# Altium project AmplifierDclass.PrjPcb
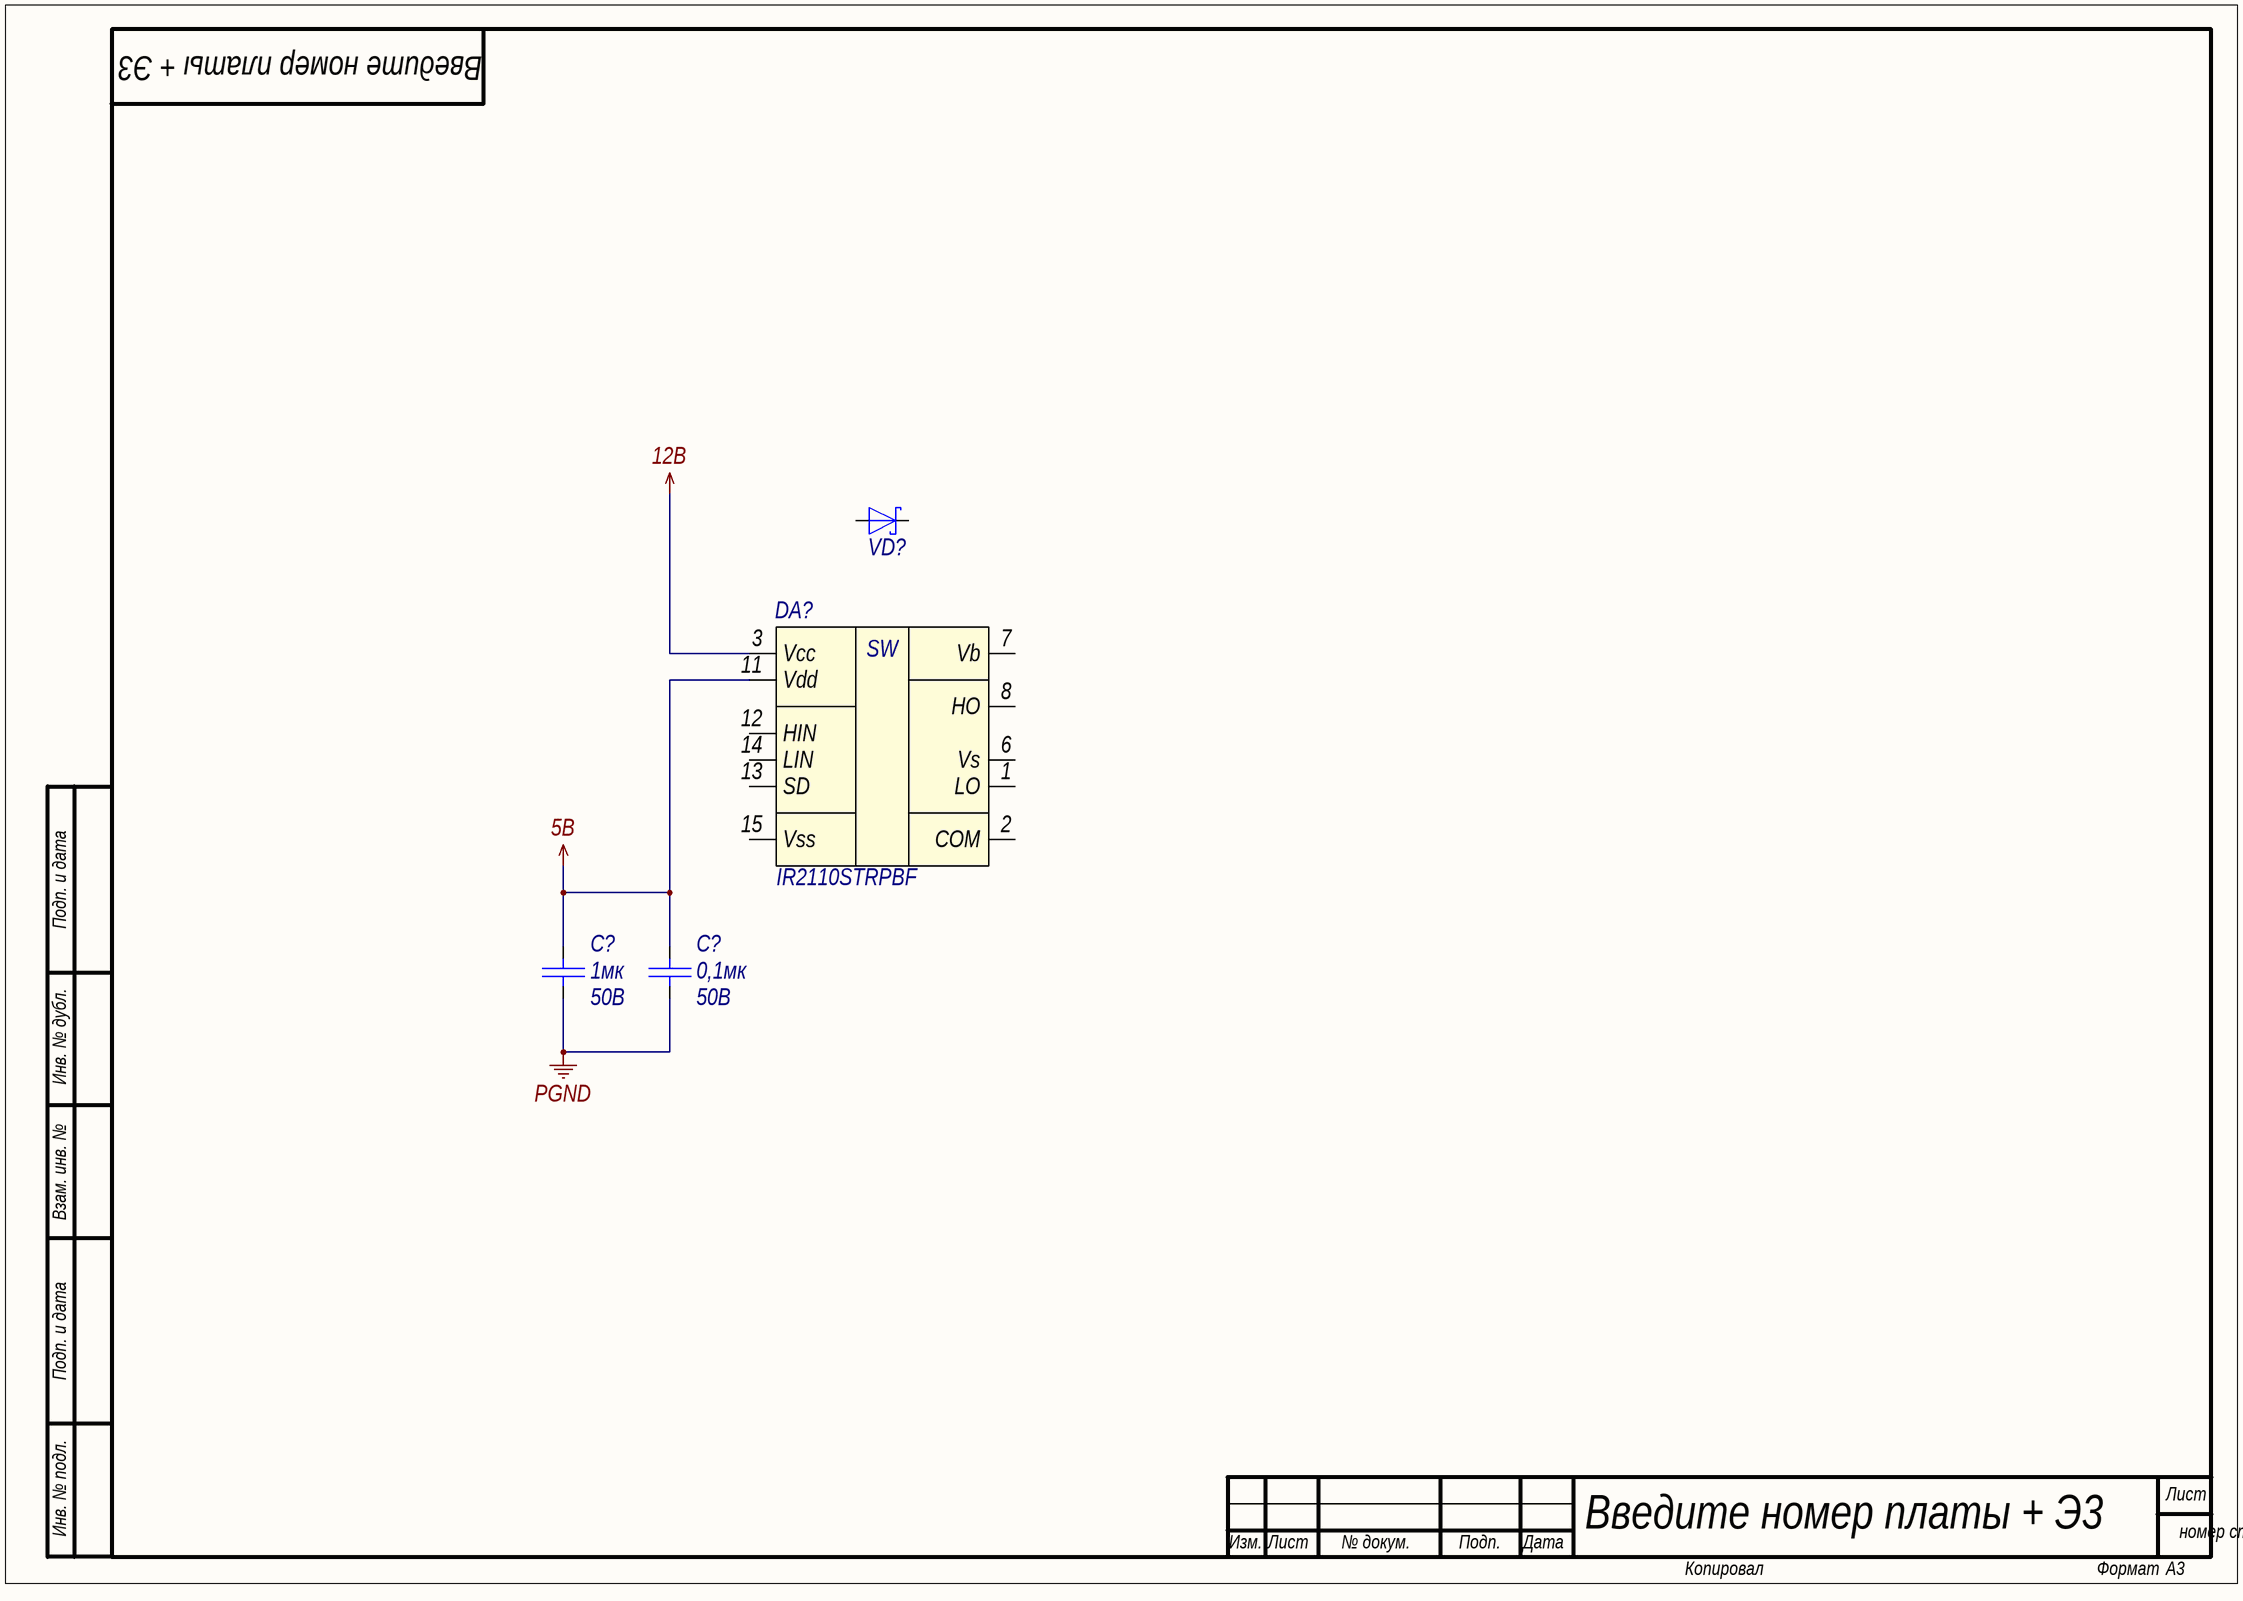
[diagram p0: AmplifierDclass_Driver.SchDoc]
6 sheets, 95 parts. Net scope: flat (ports and power ports of the same name join across sheets).
Sheets:
  AmplifierDclass_Driver.SchDoc
  AmplifierDclass_Bridge.SchDoc
  AmplifierDclass_MCU.SchDoc
  AmplifierDclass_ChokeOut.SchDoc
  AmplifierDclass_Power.SchDoc
  CutMonitor_PressureSensor.SchDoc

## Sheet AmplifierDclass_Driver.SchDoc
size 420 x 297 mm; DocumentNumber: Введите номер платы + Э3; SheetNumber: номер страницы; Format: A3

### Parts
(Parts that share a designator on the sheet are numbered #1, #2 ... from top to bottom, then left to right.)
C?#1  value 1мк  Voltage: 50B  [C0805]  (hidden comment: Capacitor)
C?#2  value 0,1мк  Voltage: 50В  [C0805]  (hidden comment: Capacitor)
DA?  Part Number: IR2110STRPBF  [SO16]  (hidden comment: IR2110S)
VD?#1  DiodeSchottky  [SMA]  (value not drawn)

### Nets
5B: C?#1.2 C?#2.2 DA?.11(Vdd)
12B: DA?.3(Vcc)
PGND: C?#1.1 C?#2.1

Not connected (* = marked no-connect by the designer): DA? 1(LO) 2(COM) 6(Vs) 7(Vb) 8(HO) 12(HIN) 13(SD) 14(LIN) 15(Vss); VD?#1 1(K) 2(A)

### Notes on the sheet
- Подп. и дата
- Инв. № дубл.
- Взам. инв. №
- Инв. № подл.
- Лист
- Изм.
- № докум.
- Подп.
- Дата
- Копировал
- Формат
- (in symbol driver23) SW

### Library data of the parts
C?#1 = cap151: Конденсатор; Part Name: Ceramic; Manufacture: Murata; Part Number: GRM21BR71H105K; id: cap151; TKE: X7R
C?#2 = cap160: Конденсатор; Part Name: Ceramic; Manufacture: Murata; Part Number: GRM21BR71H104KA01L; id: cap160; TKE: X7R
DA? = driver23: High and Low Side Driver; Manufacture: International Rectifier; Logic High: 3-20B; Logic Low: 1,5-8B; Min Operating Supply Voltage: 10B; Max Operating Supply Voltage: 20B; Maximum output current: 2,5A; id: driver23; Part Name: High and Low side Driver
VD?#1 = diode1: Диод Шоттки; Part Number: SK34A; Manufacture: Taiwan Semiconductor; id: diode1; Max Reverse Voltage: 40B; Forward Voltage: 0,55B; Forward Current: 3A; Part Name: Diode Schottky

## Sheet AmplifierDclass_Bridge.SchDoc
size 420 x 297 mm; DocumentNumber: Введите номер платы + Э3; SheetNumber: номер страницы; Format: A3
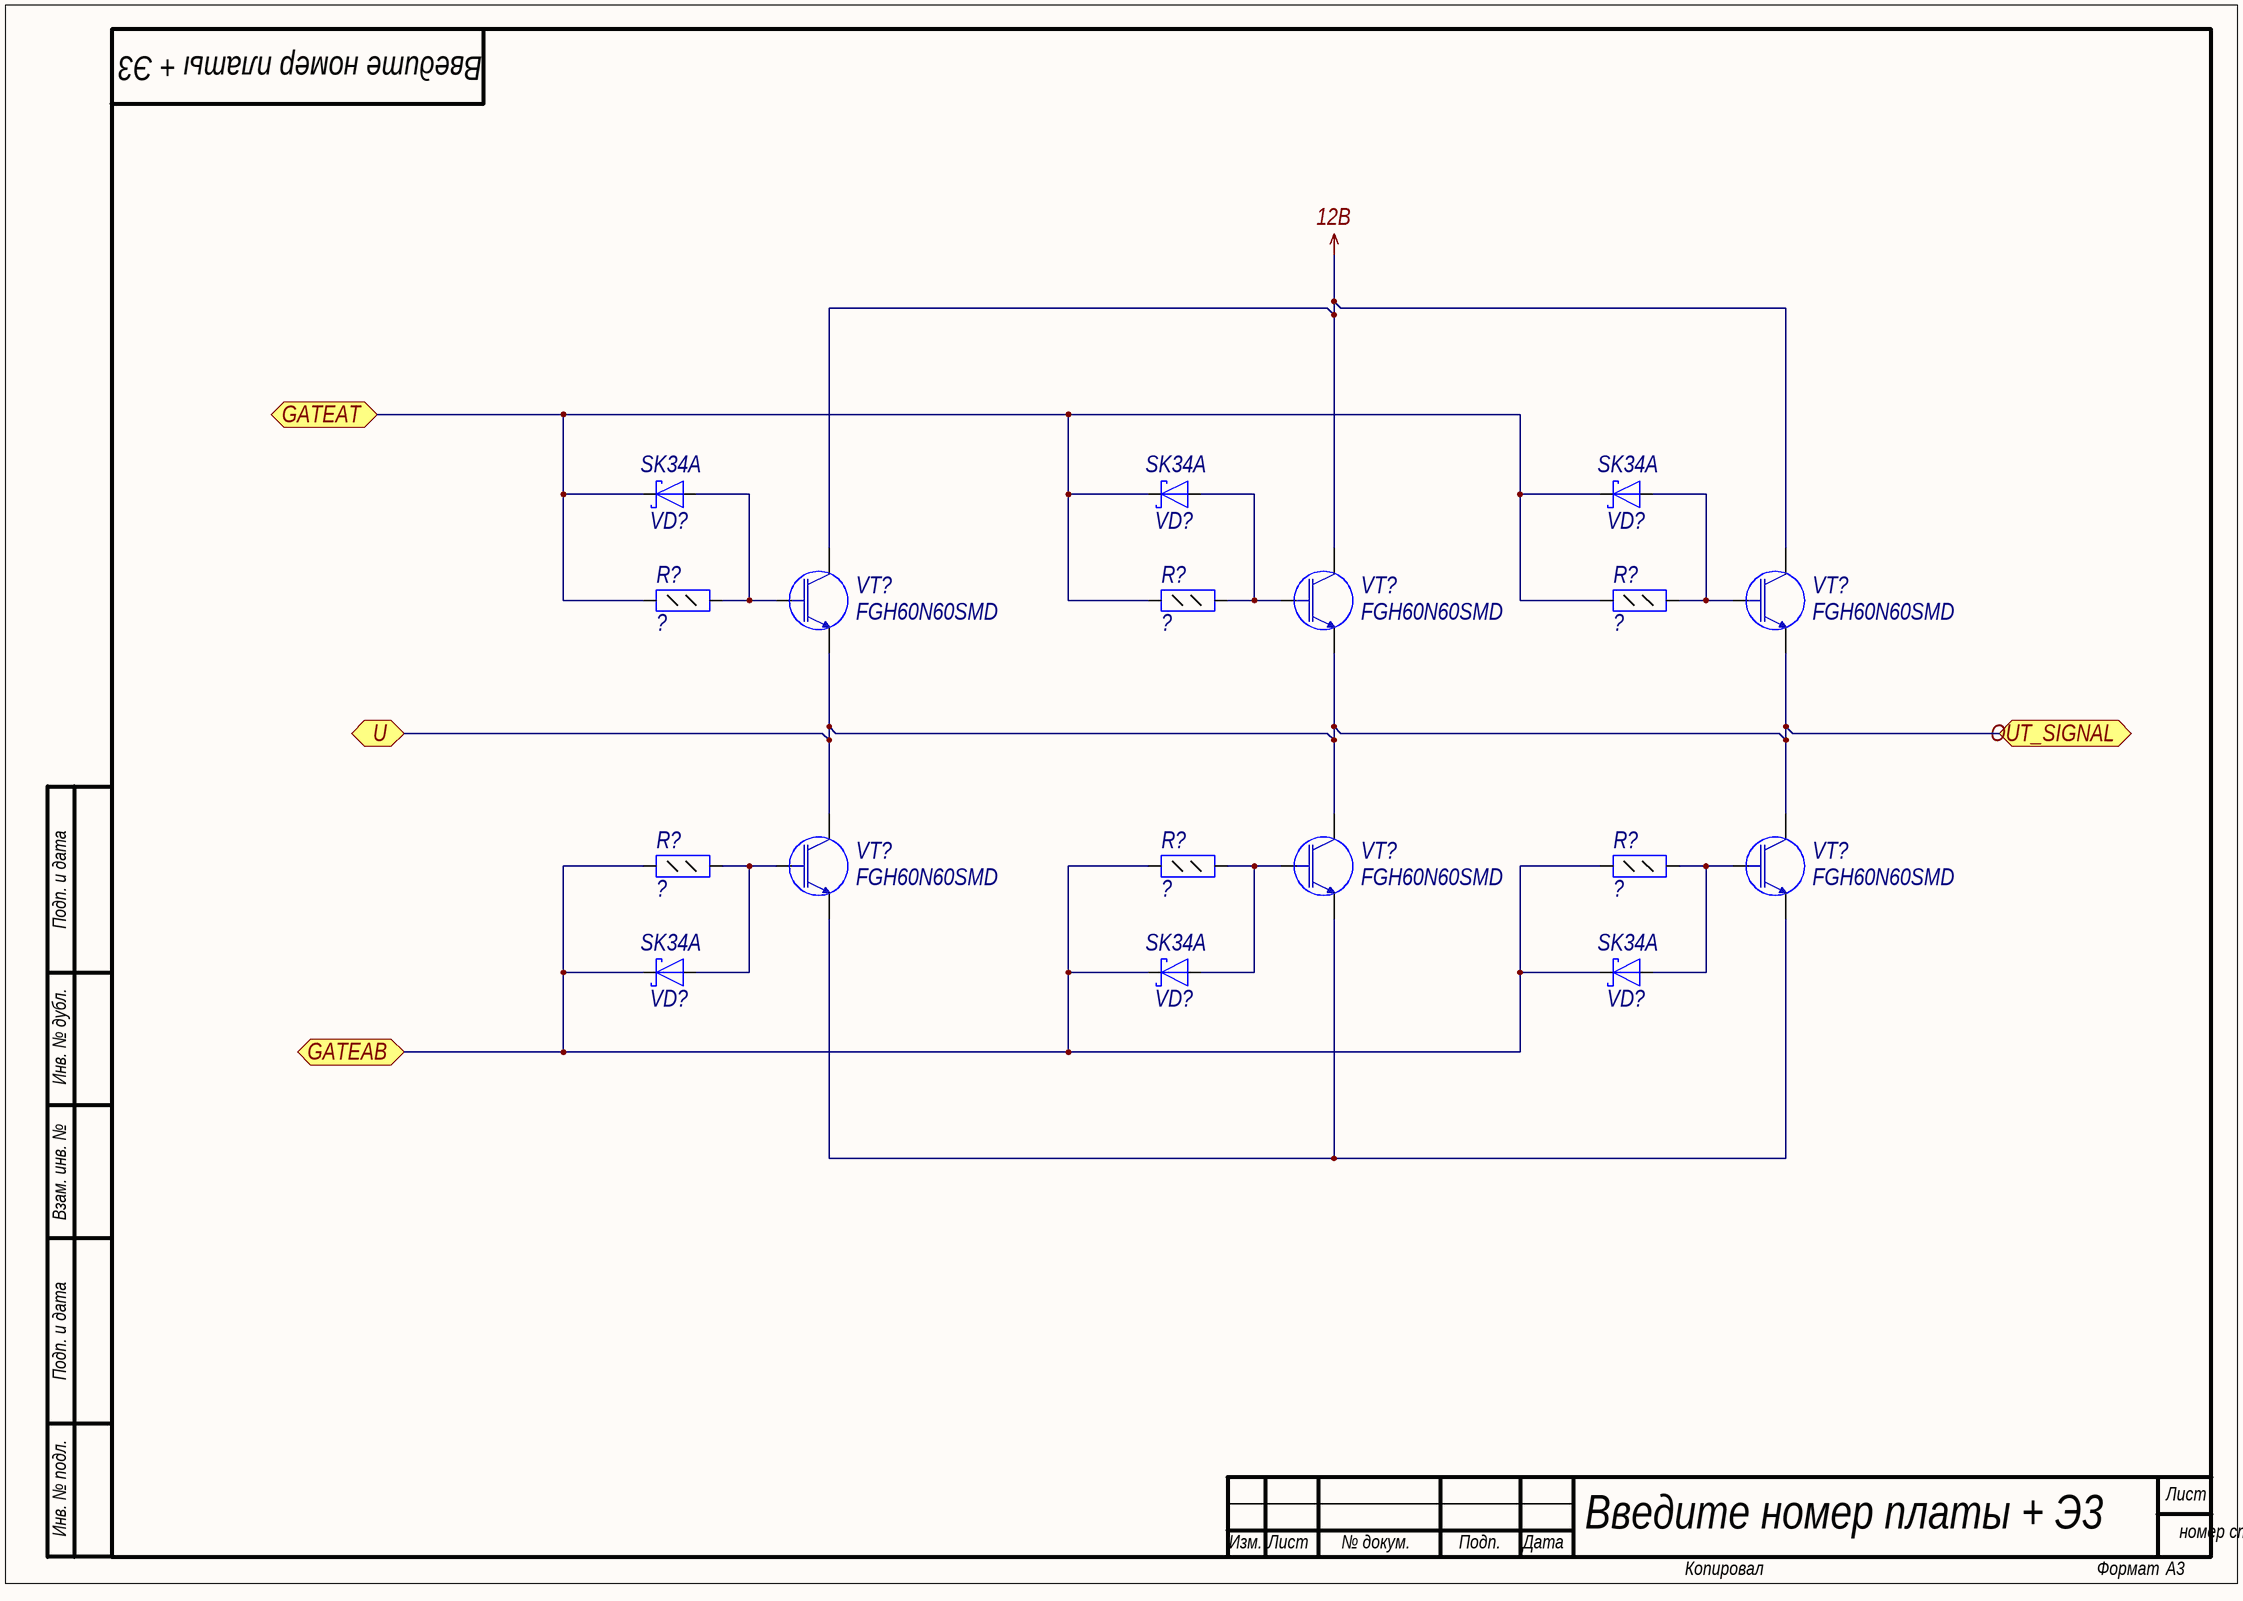
[diagram p1: AmplifierDclass_Bridge.SchDoc]

### Parts
(Parts that share a designator on the sheet are numbered #1, #2 ... from top to bottom, then left to right.)
R?#1  Resistor_0,125Вт  [R0805]  (value not drawn)
R?#2  Resistor_0,125Вт  [R0805]  (value not drawn)
R?#3  Resistor_0,125Вт  [R0805]  (value not drawn)
R?#4  Resistor_0,125Вт  [R0805]  (value not drawn)
R?#5  Resistor_0,125Вт  [R0805]  (value not drawn)
R?#6  Resistor_0,125Вт  [R0805]  (value not drawn)
VD?#2  Part Number: SK34A  [SMA]  (hidden comment: DiodeSchottky)
VD?#3  Part Number: SK34A  [SMA]  (hidden comment: DiodeSchottky)
VD?#4  Part Number: SK34A  [SMA]  (hidden comment: DiodeSchottky)
VD?#5  Part Number: SK34A  [SMA]  (hidden comment: DiodeSchottky)
VD?#6  Part Number: SK34A  [SMA]  (hidden comment: DiodeSchottky)
VD?#7  Part Number: SK34A  [SMA]  (hidden comment: DiodeSchottky)
VT?#1  Part Number: FGH60N60SMD  [TO-247_V]  (hidden comment: IGBT)
VT?#2  Part Number: FGH60N60SMD  [TO-247_V]  (hidden comment: IGBT)
VT?#3  Part Number: FGH60N60SMD  [TO-247_V]  (hidden comment: IGBT)
VT?#4  Part Number: FGH60N60SMD  [TO-247_V]  (hidden comment: IGBT)
VT?#5  Part Number: FGH60N60SMD  [TO-247_V]  (hidden comment: IGBT)
VT?#6  Part Number: FGH60N60SMD  [TO-247_V]  (hidden comment: IGBT)

### Ports
GATEAB, GATEAT, OUT_SIGNAL, U

### Nets
12B: VT?#1.2(С) VT?#2.2(С) VT?#3.2(С)
NetR?#1_1: R?#1.1 R?#2.1 R?#3.1 VD?#2.1(K) VD?#3.1(K) VD?#4.1(K) ; port GATEAT
NetR?#1_2: R?#1.2 VD?#2.2(A) VT?#1.1(G)
NetR?#2_2: R?#2.2 VD?#3.2(A) VT?#2.1(G)
NetR?#3_2: R?#3.2 VD?#4.2(A) VT?#3.1(G)
NetR?#4_1: R?#4.1 R?#5.1 R?#6.1 VD?#5.1(K) VD?#6.1(K) VD?#7.1(K) ; port GATEAB
NetR?#4_2: R?#4.2 VD?#5.2(A) VT?#4.1(G)
NetR?#5_2: R?#5.2 VD?#6.2(A) VT?#5.1(G)
NetR?#6_2: R?#6.2 VD?#7.2(A) VT?#6.1(G)
NetVT?#1_3: VT?#1.3(E) VT?#2.3(E) VT?#3.3(E) VT?#4.2(С) VT?#5.2(С) VT?#6.2(С) ; port U, port OUT_SIGNAL
NetVT?#4_3: VT?#4.3(E) VT?#5.3(E) VT?#6.3(E)

### Notes on the sheet
- Подп. и дата
- Инв. № дубл.
- Взам. инв. №
- Инв. № подл.
- Лист
- Изм.
- № докум.
- Подп.
- Дата
- Копировал
- Формат

### Library data of the parts
R?#1-R?#6 = res41: Резистор; Manufacture: Yageo; Part Number: RC0805FR-0747RL; id: res41; Accuracy: 0.01; Value: ?; Part Name: Resistor; Power: 0,125Вт
VD?#2-VD?#7 = diode1: Диод Шоттки; Manufacture: Taiwan Semiconductor; id: diode1; Max Reverse Voltage: 40B; Forward Voltage: 0,55B; Forward Current: 3A; Part Name: Diode Schottky
VT?#1-VT?#6 = FGH60N60SMD: Manufacturer: Fairchild; id: igbt0; V collector-emitter max: 600B; Gate treshold voltage: 6B(15A)-7B(45A)-8B(75A); Gate-to-emmiter voltage: (+-)20B; Total gate charge: 189 nC; Continuous collector current: 120A; Pulsed collector current: 180A; Power dissipation: 600W

## Sheet AmplifierDclass_MCU.SchDoc
size 594 x 420 mm; DocumentNumber: Введите номер платы + Э3; SheetNumber: номер страницы; Format: A2
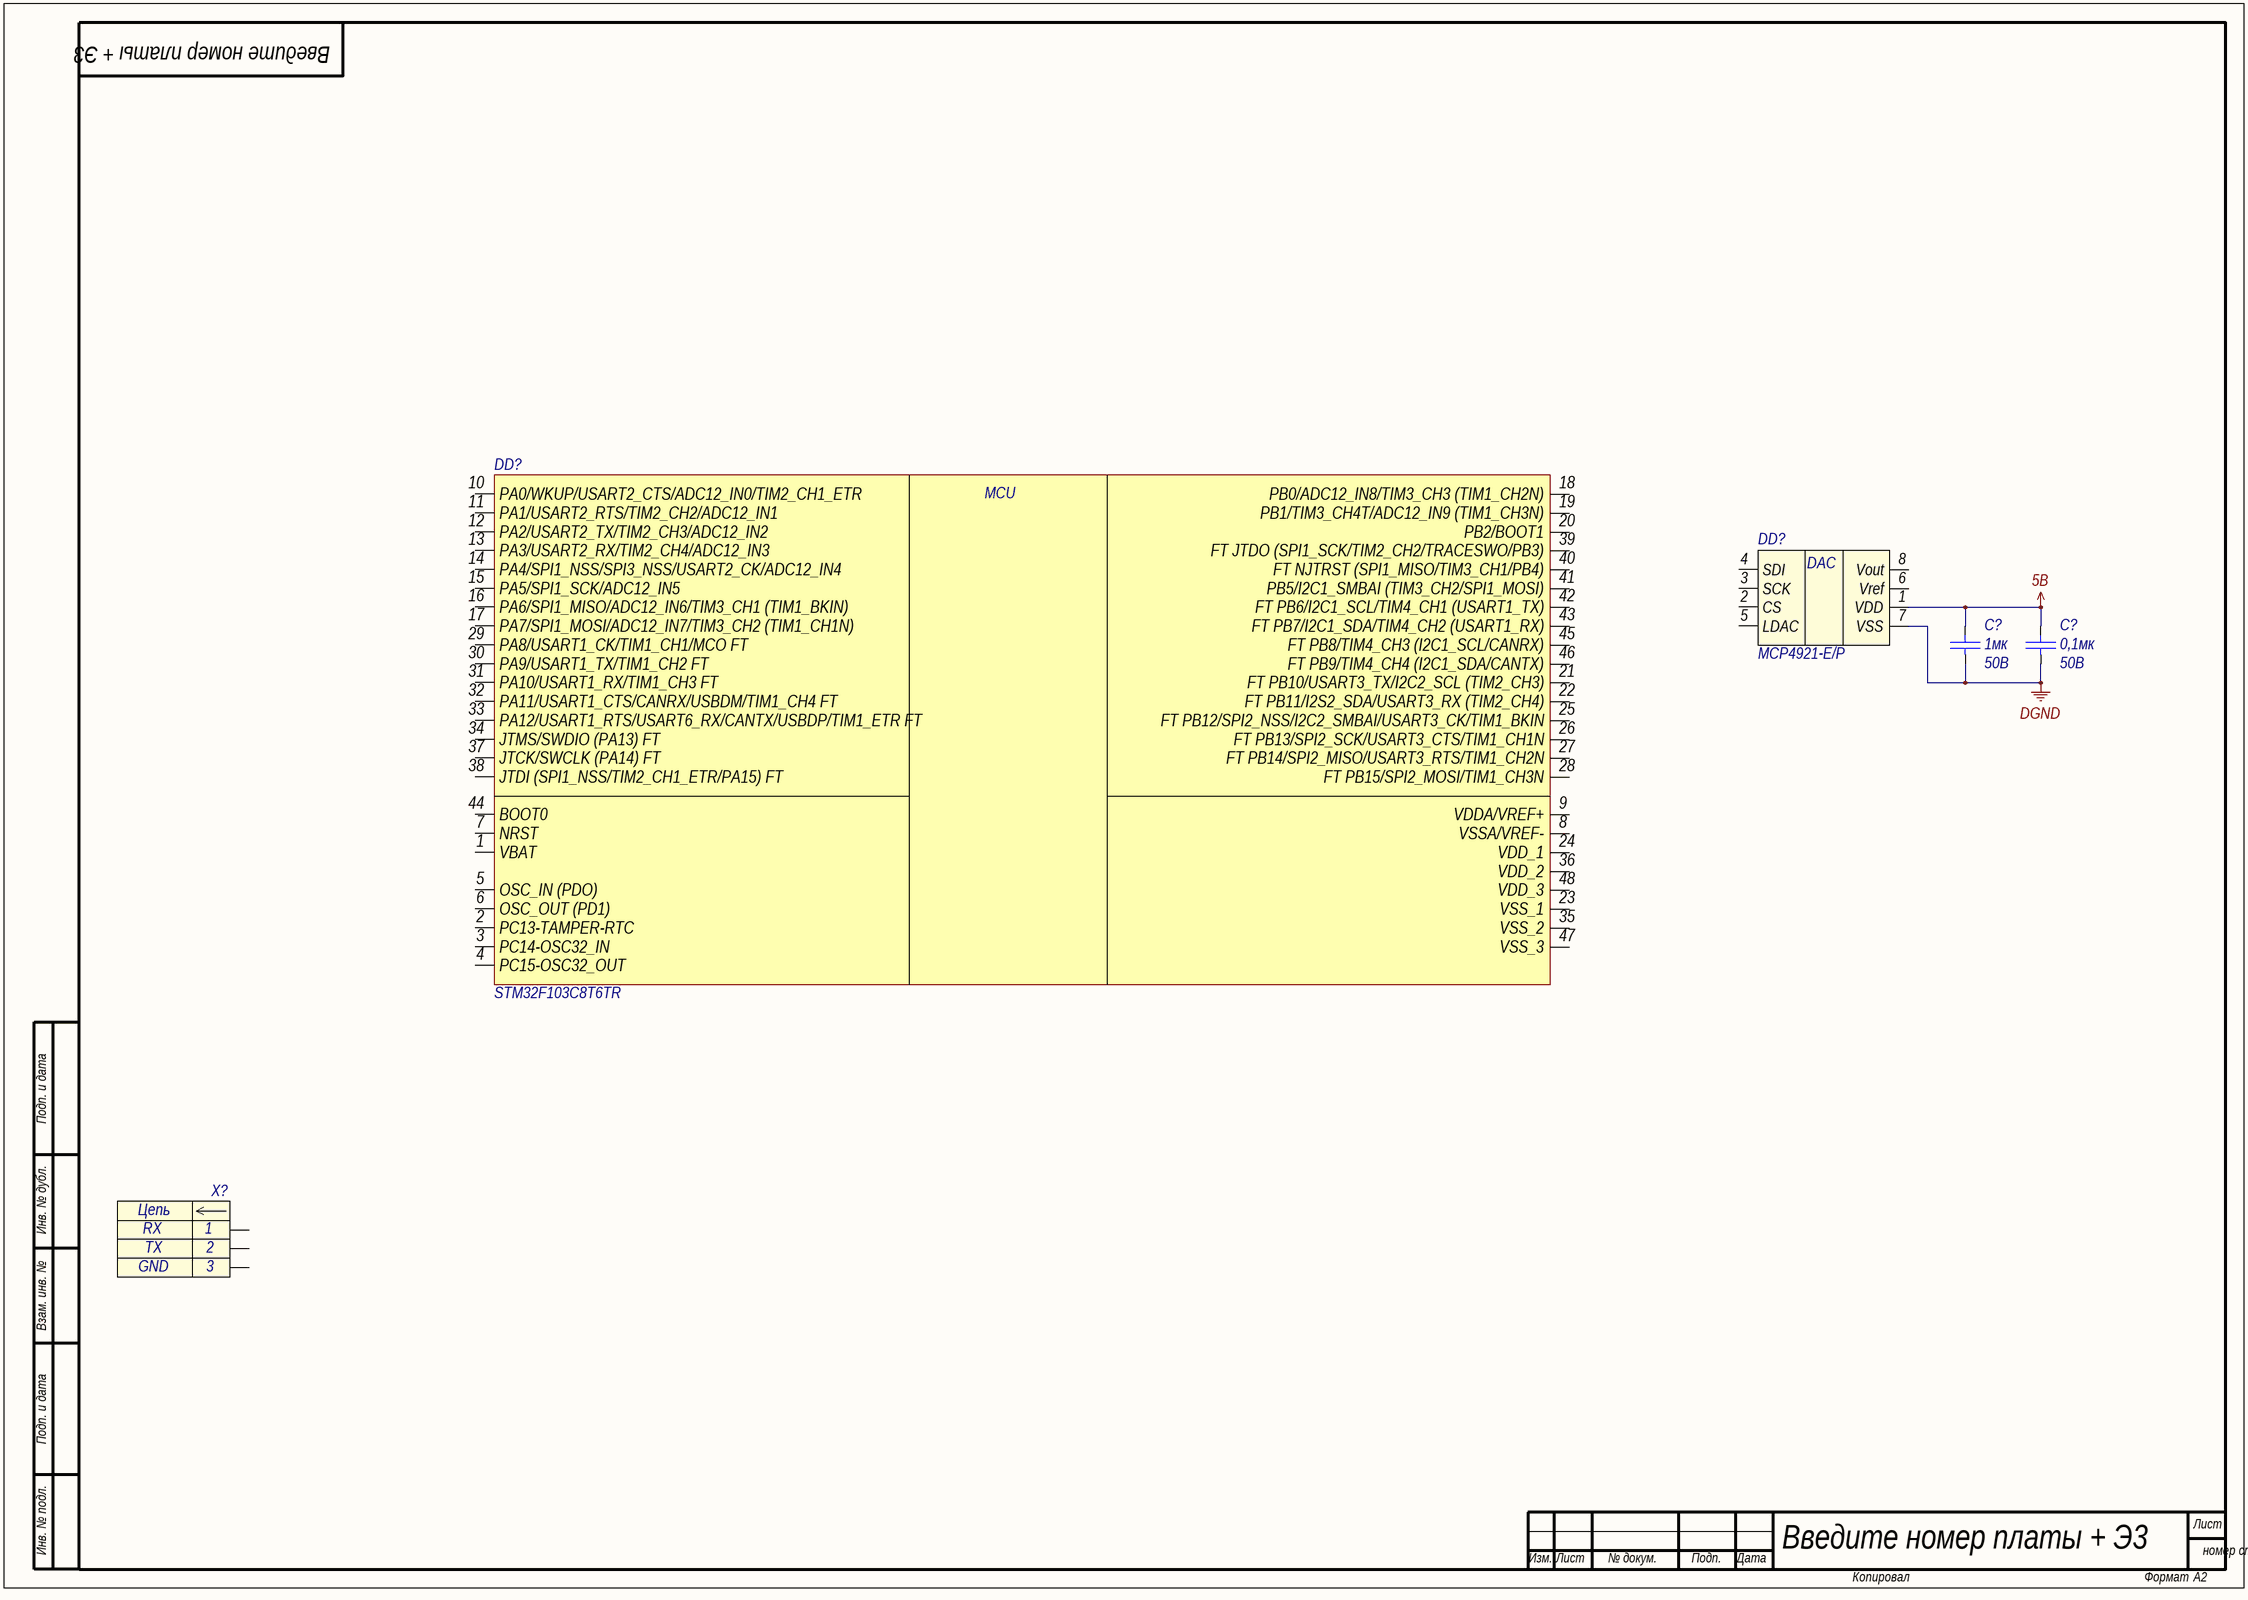
[diagram p2: AmplifierDclass_MCU.SchDoc]

### Parts
(Parts that share a designator on the sheet are numbered #1, #2 ... from top to bottom, then left to right.)
C?#3  value 1мк  Voltage: 50B  [C0805]  (hidden comment: Capacitor)
C?#4  value 0,1мк  Voltage: 50В  [C0805]  (hidden comment: Capacitor)
DD?#1  STM32F103C8T6TR  [LQFP48]
DD?#2  MCP4921-E/P  [SO8]
X?  Header_3_plg  [PLS-3]  (value not drawn)

### Nets
5B: C?#3.2 C?#4.2 DD?#2.1(VDD)
DGND: C?#3.1 C?#4.1 DD?#2.7(VSS)

Not connected (* = marked no-connect by the designer): DD?#1 1(VBAT) 2(PC13-TAMPER-RTC) 3(PC14-OSC32_IN) 4(PC15-OSC32_OUT) 5(OSC_IN_(PDO)) 6(OSC_OUT_(PD1)) 7(NRST) 8(VSSA/VREF-) 9(VDDA/VREF+) 10(PA0/WKUP/USART2_CTS/ADC12_IN0/TIM2_CH1_ETR) 11(PA1/USART2_RTS/TIM2_CH2/ADC12_IN1) 12(PA2/USART2_TX/TIM2_CH3/ADC12_IN2) 13(PA3/USART2_RX/TIM2_CH4/ADC12_IN3) 14(PA4/SPI1_NSS/SPI3_NSS/USART2_CK/ADC12_IN4) 15(PA5/SPI1_SCK/ADC12_IN5) 16(PA6/SPI1_MISO/ADC12_IN6/TIM3_CH1_(TIM1_BKIN)) 17(PA7/SPI1_MOSI/ADC12_IN7/TIM3_CH2_(TIM1_CH1N)) 18(PB0/ADC12_IN8/TIM3_CH3_(TIM1_CH2N)) 19(PB1/TIM3_CH4T/ADC12_IN9_(TIM1_CH3N)) 20(PB2/BOOT1) 21(FT_PB10/USART3_TX/I2C2_SCL_(TIM2_CH3)) 22(FT_PB11/I2S2_SDA/USART3_RX_(TIM2_CH4)) 23(VSS_1) 24(VDD_1) 25(FT_PB12/SPI2_NSS/I2C2_SMBAI/USART3_CK/TIM1_BKIN) 26(FT_PB13/SPI2_SCK/USART3_CTS/TIM1_CH1N) 27(FT_PB14/SPI2_MISO/USART3_RTS/TIM1_CH2N) 28(FT_PB15/SPI2_MOSI/TIM1_CH3N) 29(PA8/USART1_CK/TIM1_CH1/MCO_FT) 30(PA9/USART1_TX/TIM1_CH2_FT) 31(PA10/USART1_RX/TIM1_CH3_FT) 32(PA11/USART1_CTS/CANRX/USBDM/TIM1_CH4_FT) 33(PA12/USART1_RTS/USART6_RX/CANTX/USBDP/TIM1_ETR_FT) 34(JTMS/SWDIO_(PA13)_FT) 35(VSS_2) 36(VDD_2) 37(JTCK/SWCLK_(PA14)_FT) 38(JTDI_(SPI1_NSS/TIM2_CH1_ETR/PA15)_FT) 39(FT_JTDO_(SPI1_SCK/TIM2_CH2/TRACESWO/PB3)) 40(FT_NJTRST_(SPI1_MISO/TIM3_CH1/PB4)) 41(PB5/I2C1_SMBAI_(TIM3_CH2/SPI1_MOSI)) 42(FT_PB6/I2C1_SCL/TIM4_CH1_(USART1_TX)) 43(FT_PB7/I2C1_SDA/TIM4_CH2_(USART1_RX)) 44(BOOT0) 45(FT_PB8/TIM4_CH3_(I2C1_SCL/CANRX)) 46(FT_PB9/TIM4_CH4_(I2C1_SDA/CANTX)) 47(VSS_3) 48(VDD_3); DD?#2 2(CS) 3(SCK) 4(SDI) 5(LDAC) 6(Vref) 8(Vout); X? 1 2 3

### Notes on the sheet
- Подп. и дата
- Инв. № дубл.
- Взам. инв. №
- Инв. № подл.
- Лист
- Изм.
- № докум.
- Подп.
- Дата
- Копировал
- Формат
- (in symbol connect33) Цепь
- (in symbol interf10) DAC
- (in symbol microcont0) MСU

### Library data of the parts
C?#3 = cap151: as C?#1 on sheet AmplifierDclass_Driver
C?#4 = cap160: as C?#2 on sheet AmplifierDclass_Driver
DD?#1 = microcont0: Medium-density performance line ARM®-based 32-bit MCU with 64  or 128 KB Flash, USB, CAN, 7 timers, 2 ADCs, 9 com. interfaces; Part Name: Microcontroller; Frequency: 72MHz; ADC: 10x12b; Interface: can, i2c, irda, lin, spi, uart, usb; Flash: 64kb; Pin in: 37; Power Supply: 2.0-3.6 V; id: microcont0; Part Number: STM32F103C8T6TR
DD?#2 = interf10: 12-Bit DAC with SPI™ Interface; Part Name: DAC - SPI Rail-to-Rail; Manufacture: Microchip; Resolution: 12bit; Number of Channel: 2; Vref output: yes; Type Supply: Single Polar; Power Supply: 2.7-5.5V; id: interf10; Part Number: MCP4921-E/P
X? = connect33: Разъем - 3 конт. вилка; Part Number: DS1021-1*3SF112-B; Manufacture: Ningbo connfly electronic; Contact_1: RX; Contact_2: TX; Contact_3: GND; Etch: 2,54mm; Part Name: PLS-3; id: connect33

## Sheet AmplifierDclass_ChokeOut.SchDoc
size 420 x 297 mm; DocumentNumber: Введите номер платы + Э3; SheetNumber: номер страницы; Format: A3
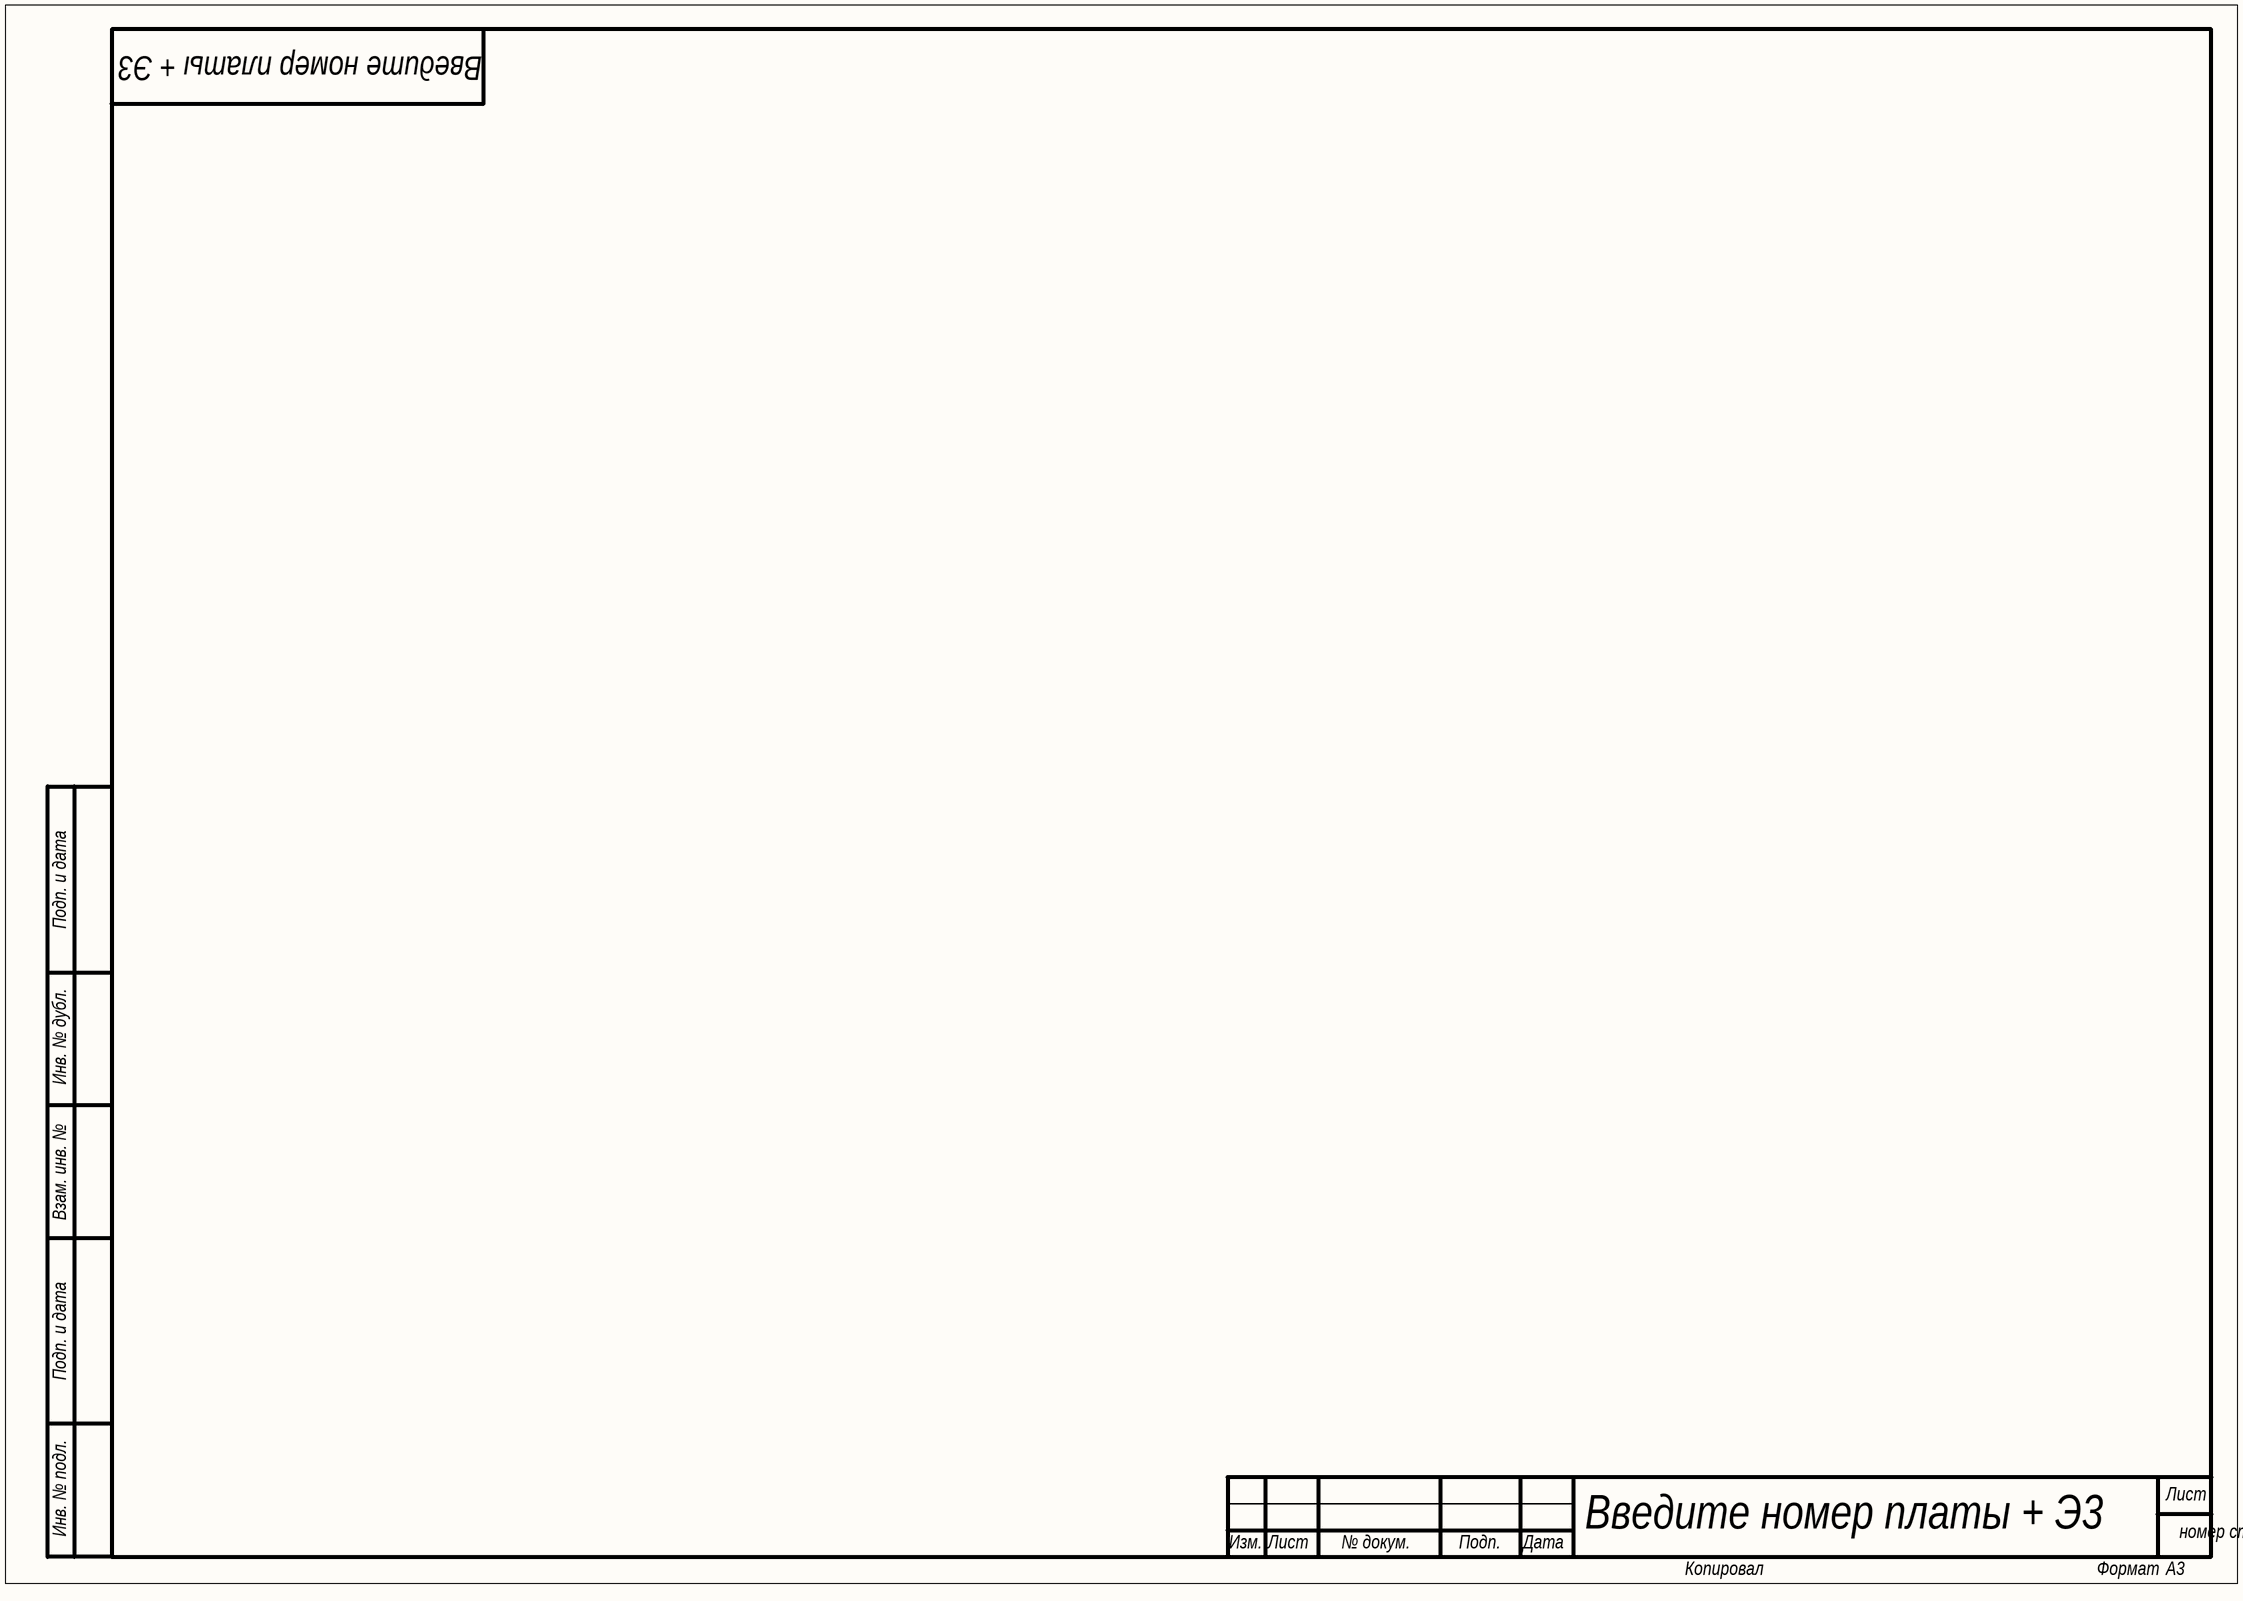
[diagram p3: AmplifierDclass_ChokeOut.SchDoc]

### Notes on the sheet
- Подп. и дата
- Инв. № дубл.
- Взам. инв. №
- Инв. № подл.
- Лист
- Изм.
- № докум.
- Подп.
- Дата
- Копировал
- Формат

## Sheet AmplifierDclass_Power.SchDoc
size 594 x 420 mm; DocumentNumber: Введите номер платы + Э3; SheetNumber: номер страницы; Format: A2
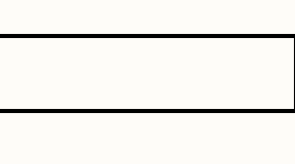
[diagram p4: AmplifierDclass_Power.SchDoc, top left]
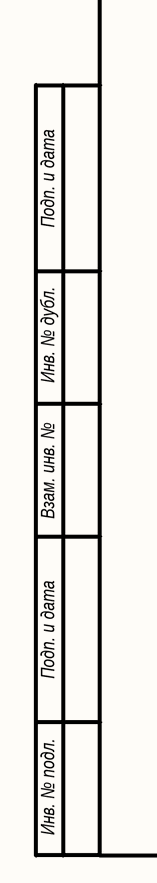
[diagram p5: AmplifierDclass_Power.SchDoc, bottom left]
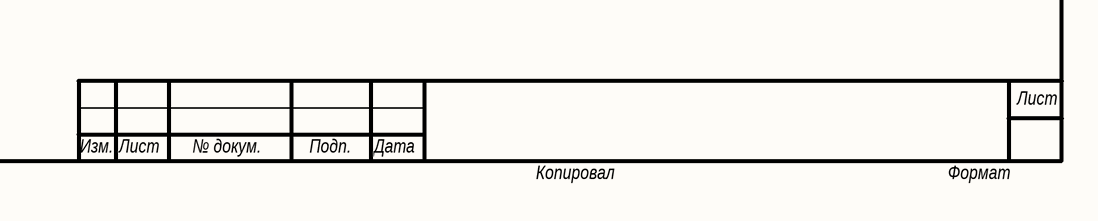
[diagram p6: AmplifierDclass_Power.SchDoc, bottom right]

### Notes on the sheet
- Подп. и дата
- Инв. № дубл.
- Взам. инв. №
- Инв. № подл.
- Лист
- Изм.
- № докум.
- Подп.
- Дата
- Копировал
- Формат

## Sheet CutMonitor_PressureSensor.SchDoc
size 594 x 420 mm; DocumentNumber: ФНКЦ.452312.001 Э3; SheetNumber: 2; Format: A2
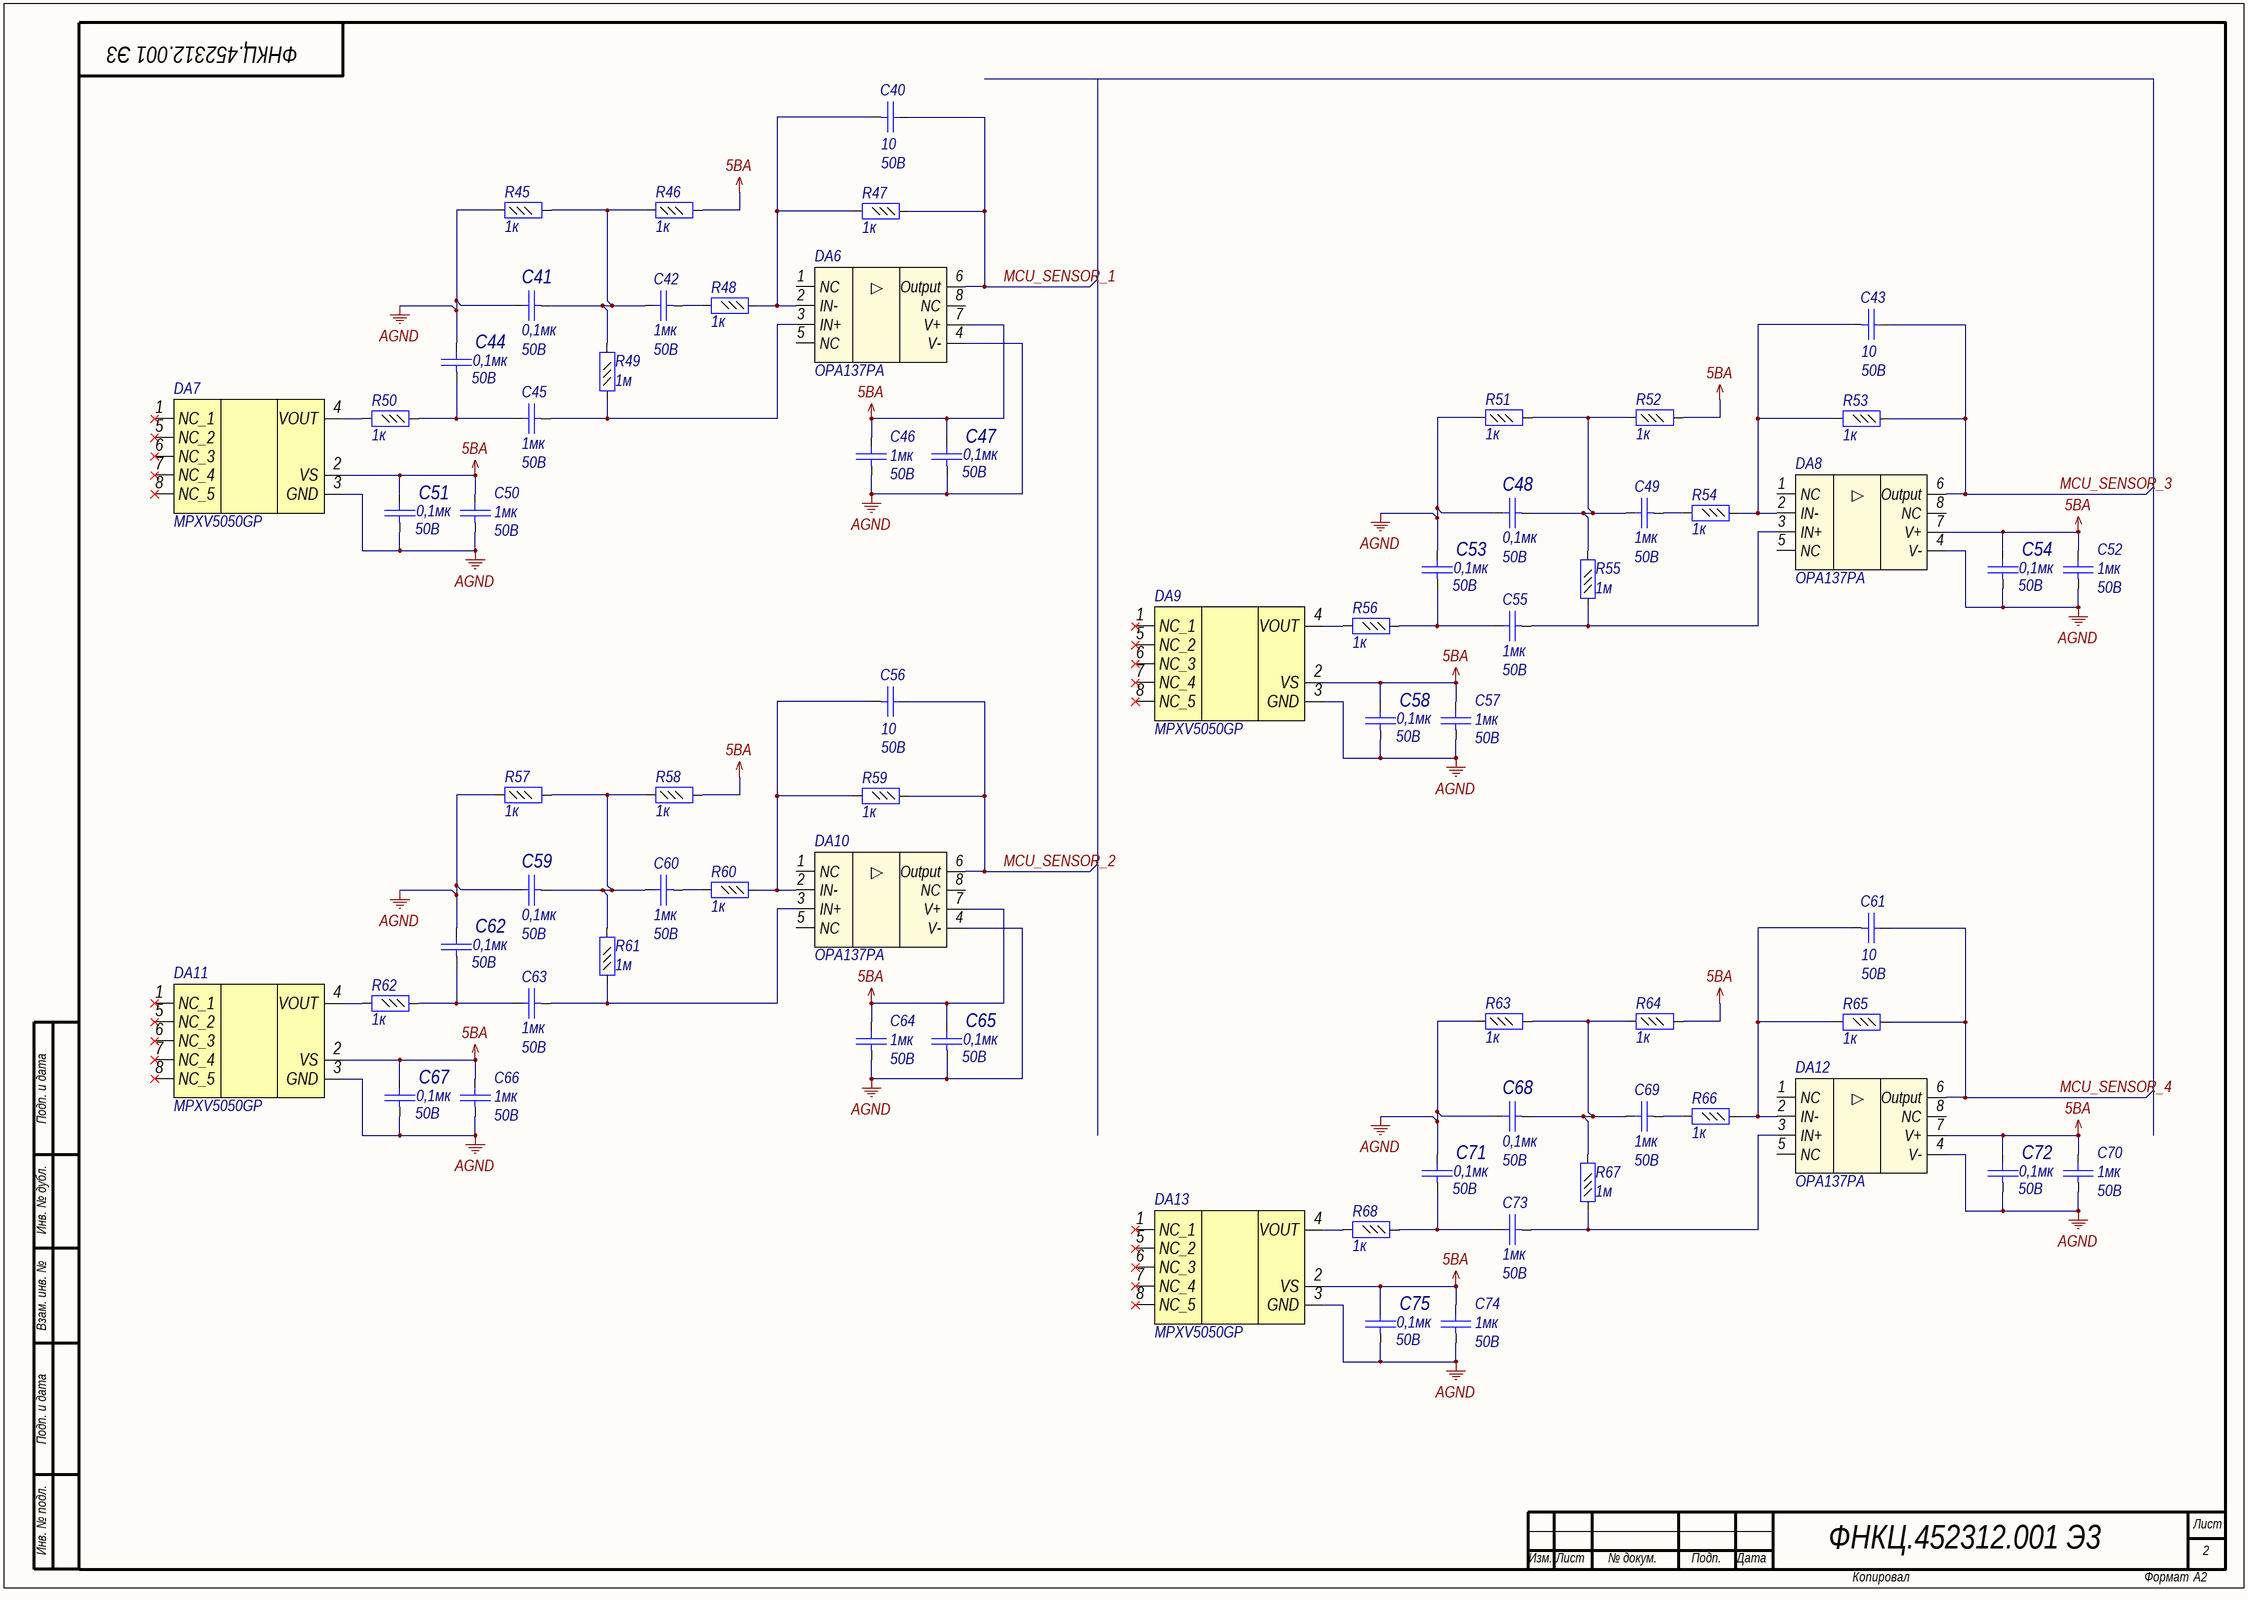
[diagram p7: CutMonitor_PressureSensor.SchDoc]

### Parts
C40  value 10  Voltage: 50B  [C0603]  (hidden comment: Capacitor)
C41  value 0,1мк  Voltage: 50B  [C0603]  (hidden comment: Capacitor)
C42  value 1мк  Voltage: 50B  [C0805]  (hidden comment: Capacitor)
C43  value 10  Voltage: 50B  [C0603]  (hidden comment: Capacitor)
C44  value 0,1мк  Voltage: 50B  [C0603]  (hidden comment: Capacitor)
C45  value 1мк  Voltage: 50B  [C0805]  (hidden comment: Capacitor)
C46  value 1мк  Voltage: 50B  [C0805]  (hidden comment: Capacitor)
C47  value 0,1мк  Voltage: 50B  [C0603]  (hidden comment: Capacitor)
C48  value 0,1мк  Voltage: 50B  [C0603]  (hidden comment: Capacitor)
C49  value 1мк  Voltage: 50B  [C0805]  (hidden comment: Capacitor)
C50  value 1мк  Voltage: 50B  [C0805]  (hidden comment: Capacitor)
C51  value 0,1мк  Voltage: 50B  [C0603]  (hidden comment: Capacitor)
C52  value 1мк  Voltage: 50B  [C0805]  (hidden comment: Capacitor)
C53  value 0,1мк  Voltage: 50B  [C0603]  (hidden comment: Capacitor)
C54  value 0,1мк  Voltage: 50B  [C0603]  (hidden comment: Capacitor)
C55  value 1мк  Voltage: 50B  [C0805]  (hidden comment: Capacitor)
C56  value 10  Voltage: 50B  [C0603]  (hidden comment: Capacitor)
C57  value 1мк  Voltage: 50B  [C0805]  (hidden comment: Capacitor)
C58  value 0,1мк  Voltage: 50B  [C0603]  (hidden comment: Capacitor)
C59  value 0,1мк  Voltage: 50B  [C0603]  (hidden comment: Capacitor)
C60  value 1мк  Voltage: 50B  [C0805]  (hidden comment: Capacitor)
C61  value 10  Voltage: 50B  [C0603]  (hidden comment: Capacitor)
C62  value 0,1мк  Voltage: 50B  [C0603]  (hidden comment: Capacitor)
C63  value 1мк  Voltage: 50B  [C0805]  (hidden comment: Capacitor)
C64  value 1мк  Voltage: 50B  [C0805]  (hidden comment: Capacitor)
C65  value 0,1мк  Voltage: 50B  [C0603]  (hidden comment: Capacitor)
C66  value 1мк  Voltage: 50B  [C0805]  (hidden comment: Capacitor)
C67  value 0,1мк  Voltage: 50B  [C0603]  (hidden comment: Capacitor)
C68  value 0,1мк  Voltage: 50B  [C0603]  (hidden comment: Capacitor)
C69  value 1мк  Voltage: 50B  [C0805]  (hidden comment: Capacitor)
C70  value 1мк  Voltage: 50B  [C0805]  (hidden comment: Capacitor)
C71  value 0,1мк  Voltage: 50B  [C0603]  (hidden comment: Capacitor)
C72  value 0,1мк  Voltage: 50B  [C0603]  (hidden comment: Capacitor)
C73  value 1мк  Voltage: 50B  [C0805]  (hidden comment: Capacitor)
C74  value 1мк  Voltage: 50B  [C0805]  (hidden comment: Capacitor)
C75  value 0,1мк  Voltage: 50B  [C0603]  (hidden comment: Capacitor)
DA6  OPA137PA  [DIP8]
DA7  MPXV5050GP  [SOP8]
DA8  OPA137PA  [DIP8]
DA9  MPXV5050GP  [SOP8]
DA10  OPA137PA  [DIP8]
DA11  MPXV5050GP  [SOP8]
DA12  OPA137PA  [DIP8]
DA13  MPXV5050GP  [SOP8]
R45  value 1к  [R0603]  (hidden comment: Resistor_0,062Вт)
R46  value 1к  [R0603]  (hidden comment: Resistor_0,062Вт)
R47  value 1к  [R0603]  (hidden comment: Resistor_0,062Вт)
R48  value 1к  [R0603]  (hidden comment: Resistor_0,062Вт)
R49  value 1м  [R0603]  (hidden comment: Resistor_0,062Вт)
R50  value 1к  [R0603]  (hidden comment: Resistor_0,062Вт)
R51  value 1к  [R0603]  (hidden comment: Resistor_0,062Вт)
R52  value 1к  [R0603]  (hidden comment: Resistor_0,062Вт)
R53  value 1к  [R0603]  (hidden comment: Resistor_0,062Вт)
R54  value 1к  [R0603]  (hidden comment: Resistor_0,062Вт)
R55  value 1м  [R0603]  (hidden comment: Resistor_0,062Вт)
R56  value 1к  [R0603]  (hidden comment: Resistor_0,062Вт)
R57  value 1к  [R0603]  (hidden comment: Resistor_0,062Вт)
R58  value 1к  [R0603]  (hidden comment: Resistor_0,062Вт)
R59  value 1к  [R0603]  (hidden comment: Resistor_0,062Вт)
R60  value 1к  [R0603]  (hidden comment: Resistor_0,062Вт)
R61  value 1м  [R0603]  (hidden comment: Resistor_0,062Вт)
R62  value 1к  [R0603]  (hidden comment: Resistor_0,062Вт)
R63  value 1к  [R0603]  (hidden comment: Resistor_0,062Вт)
R64  value 1к  [R0603]  (hidden comment: Resistor_0,062Вт)
R65  value 1к  [R0603]  (hidden comment: Resistor_0,062Вт)
R66  value 1к  [R0603]  (hidden comment: Resistor_0,062Вт)
R67  value 1м  [R0603]  (hidden comment: Resistor_0,062Вт)
R68  value 1к  [R0603]  (hidden comment: Resistor_0,062Вт)

### Nets
5BA: C46.2 C47.2 C50.2 C51.2 C52.2 C54.2 C57.2 C58.2 C64.2 C65.2 C66.2 C67.2 C70.2 C72.2 C74.2 C75.2 DA6.7(V+) DA7.2(VS) DA8.7(V+) DA9.2(VS) DA10.7(V+) DA11.2(VS) DA12.7(V+) DA13.2(VS) R46.2 R52.2 R58.2 R64.2
AGND: C41.2 C44.2 C46.1 C47.1 C48.2 C50.1 C51.1 C52.1 C53.2 C54.1 C57.1 C58.1 C59.2 C62.2 C64.1 C65.1 C66.1 C67.1 C68.2 C70.1 C71.2 C72.1 C74.1 C75.1 DA6.4(V-) DA7.3(GND) DA8.4(V-) DA9.3(GND) DA10.4(V-) DA11.3(GND) DA12.4(V-) DA13.3(GND) R45.1 R51.1 R57.1 R63.1
MCU_SENSOR_1: C40.2 DA6.6(Output) R47.1
MCU_SENSOR_2: C56.2 DA10.6(Output) R59.1
MCU_SENSOR_3: C43.2 DA8.6(Output) R53.1
MCU_SENSOR_4: C61.2 DA12.6(Output) R65.1
NetC40_1: C40.1 DA6.2(IN-) R47.2 R48.1
NetC41_1: C41.1 C42.2 R45.2 R46.1 R49.2
NetC42_1: C42.1 R48.2
NetC43_1: C43.1 DA8.2(IN-) R53.2 R54.1
NetC44_1: C44.1 C45.2 R50.1
NetC45_1: C45.1 DA6.3(IN+) R49.1
NetC48_1: C48.1 C49.2 R51.2 R52.1 R55.2
NetC49_1: C49.1 R54.2
NetC53_1: C53.1 C55.2 R56.1
NetC55_1: C55.1 DA8.3(IN+) R55.1
NetC56_1: C56.1 DA10.2(IN-) R59.2 R60.1
NetC59_1: C59.1 C60.2 R57.2 R58.1 R61.2
NetC60_1: C60.1 R60.2
NetC61_1: C61.1 DA12.2(IN-) R65.2 R66.1
NetC62_1: C62.1 C63.2 R62.1
NetC63_1: C63.1 DA10.3(IN+) R61.1
NetC68_1: C68.1 C69.2 R63.2 R64.1 R67.2
NetC69_1: C69.1 R66.2
NetC71_1: C71.1 C73.2 R68.1
NetC73_1: C73.1 DA12.3(IN+) R67.1
NetDA7_4: DA7.4(VOUT) R50.2
NetDA9_4: DA9.4(VOUT) R56.2
NetDA11_4: DA11.4(VOUT) R62.2
NetDA13_4: DA13.4(VOUT) R68.2

Not connected (* = marked no-connect by the designer): DA6 1(NC) 5(NC) 8(NC); DA7 1(NC_1)* 5(NC_2)* 6(NC_3)* 7(NC_4)* 8(NC_5)*; DA8 1(NC) 5(NC) 8(NC); DA9 1(NC_1)* 5(NC_2)* 6(NC_3)* 7(NC_4)* 8(NC_5)*; DA10 1(NC) 5(NC) 8(NC); DA11 1(NC_1)* 5(NC_2)* 6(NC_3)* 7(NC_4)* 8(NC_5)*; DA12 1(NC) 5(NC) 8(NC); DA13 1(NC_1)* 5(NC_2)* 6(NC_3)* 7(NC_4)* 8(NC_5)*

### Notes on the sheet
- Подп. и дата
- Инв. № дубл.
- Взам. инв. №
- Инв. № подл.
- Лист
- Изм.
- № докум.
- Подп.
- Дата
- Копировал
- Формат

### Library data of the parts
C40 C43 C56 C61 = cap71: Конденсатор; Part Name: Ceramic; Manufacture: Murata; Part Number: GRM1885C1H100J; id: cap71; TKE: NP0
C41 C44 C47 C48 C51 C53 C54 C58 C59 C62 C65 C67 C68 C71 C72 C75 = cap131: Конденсатор; Part Name: Ceramic; Manufacture: Murata; Part Number: GRM188R71H104KA93D; id: cap131; TKE: X7R
C42 C45 C46 C49 C50 C52 C55 C57 C60 C63 C64 C66 C69 C70 C73 C74 = cap151: as C?#1 on sheet AmplifierDclass_Driver
DA6 DA8 DA10 DA12 = amp11: FET-INPUT OPERATIONAL AMPLIFIERS; Part Name: FET-INPUT Amplifier; Manufacture: Texas Instruments; id: amp11; Rail-to-rail: yes; Supply Voltage: 4,5-36B; Bandwidth: 1МГц; Input Bias Current: 100pA; CMRR: 76-84dB; PSRR: 80,92dB; Offset voltage: 2,5mB; Channels: 1; Part Number: OPA137PA
DA7 DA9 DA11 DA13 = MPXV5050GP: Integrated Silicon Pressure Sensor; Manufacture: Freescale Semiconductor; id: sensor4; Interface: ANALOG; Part Number: MPXV5050GP; Part Name: Integrated Silicon Pressure Sensor; Type sensor: Pressure
R45-R48 R50-R54 R56-R60 R62-R66 R68 = res459: Резистор; Manufacture: Yageo; Part Number: RC0603FR-071KL; id: res459; Accuracy: 0,01; Part Name: Resistor; Power: 0,062Вт
R49 R55 R61 R67 = res531: Резистор; Manufacture: Yageo; Part Number: RC0603FR-071ML; id: res531; Accuracy: 0,01; Part Name: Resistor; Power: 0,062Вт

## Nets that join several sheets
5B: AmplifierDclass_Driver (C?#1.2 C?#2.2 DA?.11), AmplifierDclass_MCU (C?#3.2 C?#4.2 DD?#2.1)
12B: AmplifierDclass_Driver (DA?.3), AmplifierDclass_Bridge (VT?#1.2 VT?#2.2 VT?#3.2)